# Altium schematic sheet [03] - CONNECTORS.SchDoc
size A2; DocumentNumber: 3; SheetNumber: 3; SheetTotal: 18
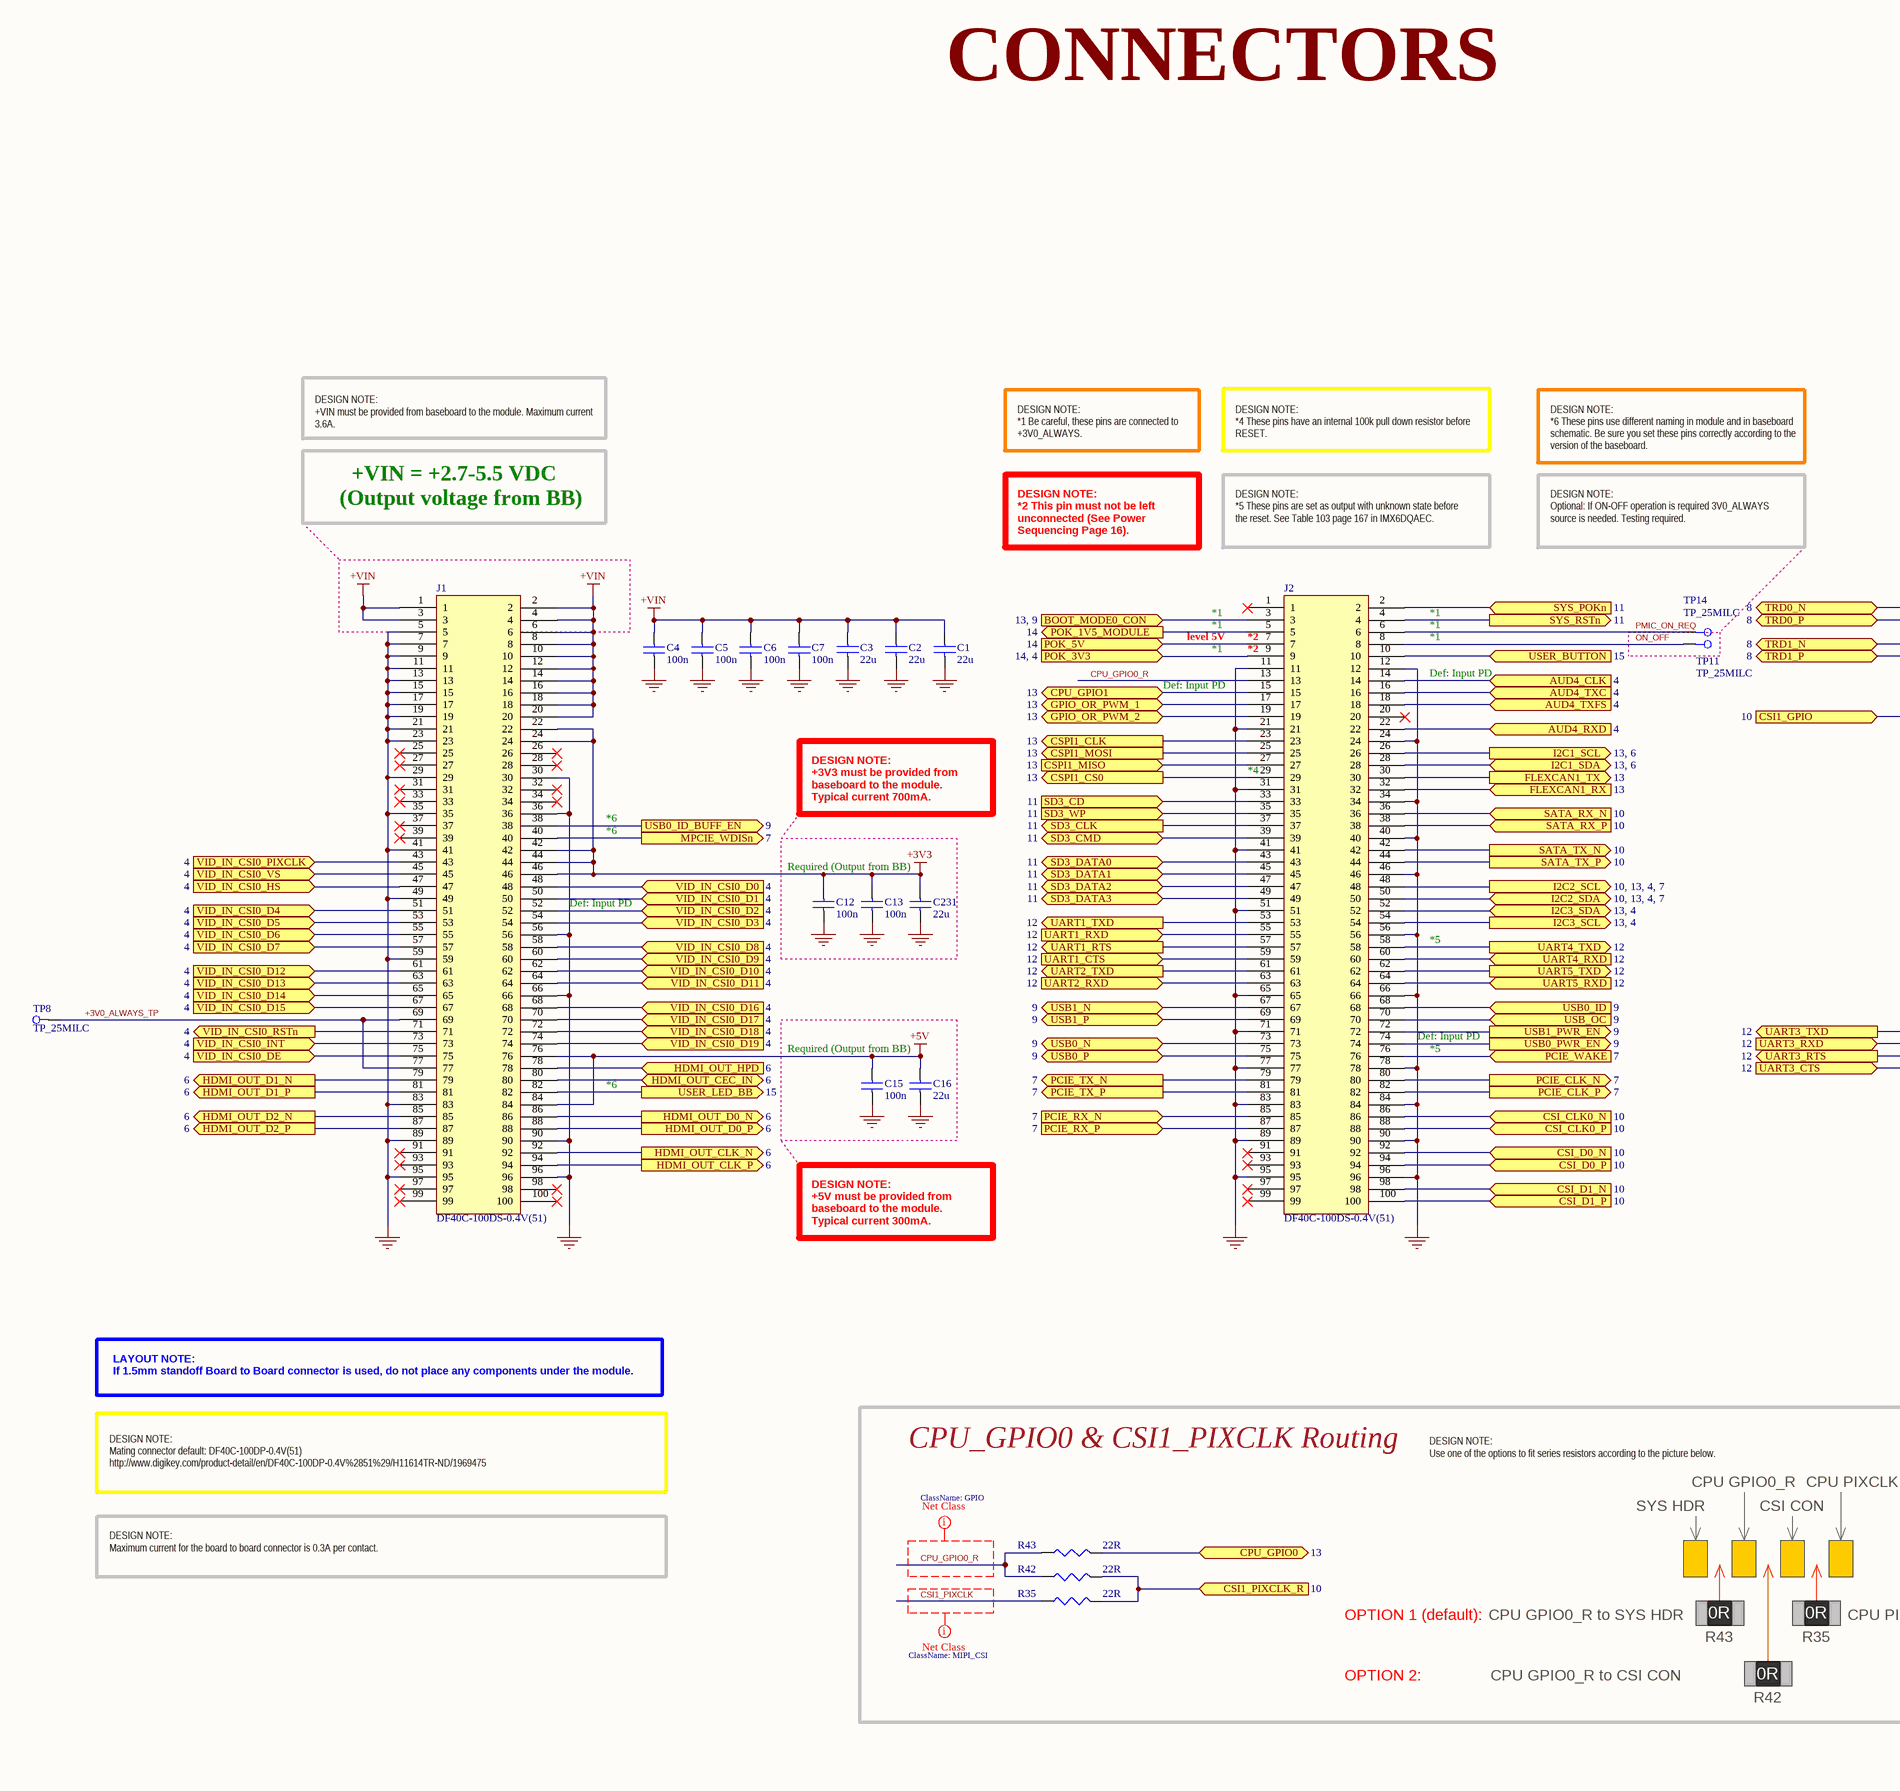
[diagram p0: [03] - CONNECTORS.SchDoc, left]
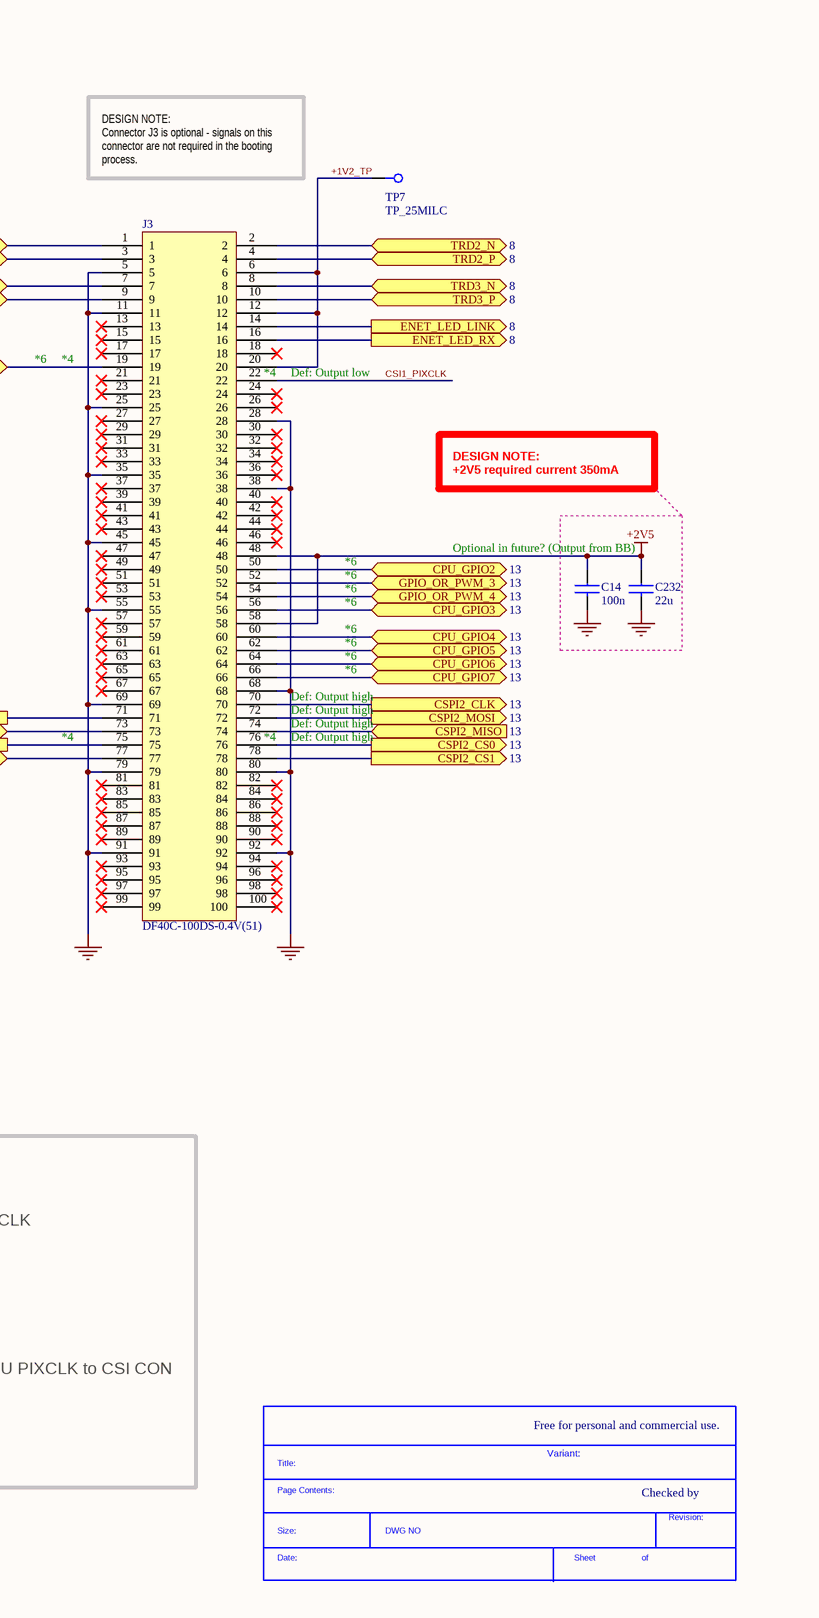
[diagram p1: [03] - CONNECTORS.SchDoc, right]

## Parts
*  SDTitleBlock  (value not drawn)  (graphical)
C1  22u  [C0603]
C2  22u  [C0603]
C3  22u  [C0603]
C4  100n  [C0402]
C5  100n  [C0402]
C6  100n  [C0402]
C7  100n  [C0402]
C12  100n  [C0402]
C13  100n  [C0402]
C14  100n  [C0402]
C15  100n  [C0402]
C16  22u  [C0603]
C231  22u  [C0603]
C232  22u  [C0603]
J1  DF40C-100DS-0.4V(51)  [DF40C-100DS-0.4V(51)_V1.1]
J2  DF40C-100DS-0.4V(51)  [DF40C-100DS-0.4V(51)_V1.1]
J3  DF40C-100DS-0.4V(51)  [DF40C-100DS-0.4V(51)_V1.1]
R35  22R  [R0402]
R42  22R  [R0402]
R43  22R  [R0402]
TP7  TP_25MILC  [TP_25C]  (no BOM)
TP8  TP_25MILC  [TP_25C]  (no BOM)
TP11  TP_25MILC  [TP_25C]  (no BOM)
TP14  TP_25MILC  [TP_25C]  (no BOM)

## Blocks framed on the sheet
Required (Output from BB): C12 C13 C231
Required (Output from BB): C15 C16
CPU_GPIO0 & CSI1_PIXCLK Routing: R35 R42 R43

## Ports
AUD4_CLK (in, see 4), AUD4_RXD (in, see 4), AUD4_TXC (in, see 4), AUD4_TXFS (in, see 4), BOOT_MODE0_CON (see 13, 9), CPU_GPIO0 (bidir, see 13), CPU_GPIO1 (bidir, see 13), CPU_GPIO2 (bidir, see 13), CPU_GPIO3 (bidir, see 13), CPU_GPIO4 (bidir, see 13), CPU_GPIO5 (bidir, see 13), CPU_GPIO6 (bidir, see 13), CPU_GPIO7 (bidir, see 13), CSI1_GPIO (in, see 10), CSI1_PIXCLK_R (in, see 10), CSI_CLK0_N (in, see 10), CSI_CLK0_P (in, see 10), CSI_D0_N (in, see 10), CSI_D0_P (in, see 10), CSI_D1_N (in, see 10), CSI_D1_P (in, see 10), CSPI1_CLK (out, see 13), CSPI1_CS0 (out, see 13), CSPI1_MISO (in, see 13), CSPI1_MOSI (out, see 13), CSPI2_CLK (out, see 13), CSPI2_CS0 (out, see 13), CSPI2_CS1 (out, see 13), CSPI2_MISO (in, see 13), CSPI2_MOSI (out, see 13), ENET_LED_LINK (out, see 8), ENET_LED_RX (out, see 8), FLEXCAN1_RX (in, see 13), FLEXCAN1_TX (out, see 13), GPIO_OR_PWM_1 (bidir, see 13), GPIO_OR_PWM_2 (bidir, see 13), GPIO_OR_PWM_3 (bidir, see 13), GPIO_OR_PWM_4 (bidir, see 13), HDMI_OUT_CEC_IN (bidir, see 6), HDMI_OUT_CLK_N (out, see 6), HDMI_OUT_CLK_P (out, see 6), HDMI_OUT_D0_N (out, see 6), HDMI_OUT_D0_P (out, see 6), HDMI_OUT_D1_N (out, see 6), HDMI_OUT_D1_P (out, see 6), HDMI_OUT_D2_N (out, see 6), HDMI_OUT_D2_P (out, see 6), HDMI_OUT_HPD (in, see 6), I2C1_SCL (see 13, 6), I2C1_SDA (bidir, see 13, 6), I2C2_SCL (see 10, 13, 4, 7), I2C2_SDA (bidir, see 10, 13, 4, 7), I2C3_SCL (see 13, 4), I2C3_SDA (bidir, see 13, 4), MPCIE_WDISn (out, see 7), PCIE_CLK_N (out, see 7), PCIE_CLK_P (out, see 7), PCIE_RX_N (in, see 7), PCIE_RX_P (in, see 7), PCIE_TX_N (out, see 7), PCIE_TX_P (out, see 7), PCIE_WAKE (in, see 7), POK_1V5_MODULE (out, see 14), POK_3V3 (see 14, 4), POK_5V (in, see 14), SATA_RX_N (in, see 10), SATA_RX_P (in, see 10), SATA_TX_N (out, see 10), SATA_TX_P (out, see 10), SD3_CD (in, see 11), SD3_CLK (out, see 11), SD3_CMD (bidir, see 11), SD3_DATA0 (bidir, see 11), SD3_DATA1 (bidir, see 11), SD3_DATA2 (bidir, see 11), SD3_DATA3 (bidir, see 11), SD3_WP (in, see 11), SYS_POKn (in, see 11), SYS_RSTn (out, see 11), TRD0_N (bidir, see 8), TRD0_P (bidir, see 8), TRD1_N (bidir, see 8), TRD1_P (bidir, see 8), TRD2_N (bidir, see 8), TRD2_P (bidir, see 8), TRD3_N (bidir, see 8), TRD3_P (bidir, see 8), UART1_CTS (in, see 12), UART1_RTS (out, see 12), UART1_RXD (in, see 12), UART1_TXD (out, see 12), UART2_RXD (in, see 12), UART2_TXD (out, see 12), UART3_CTS (in, see 12), UART3_RTS (out, see 12), UART3_RXD (in, see 12), UART3_TXD (out, see 12), UART4_RXD (in, see 12), UART4_TXD (out, see 12), UART5_RXD (in, see 12), UART5_TXD (out, see 12), USB0_ID (in, see 9), USB0_ID_BUFF_EN (out, see 9), USB0_N (bidir, see 9), USB0_P (bidir, see 9), USB0_PWR_EN (out, see 9), USB1_N (bidir, see 9), USB1_P (bidir, see 9), USB1_PWR_EN (out, see 9), USB_OC (in, see 9), USER_BUTTON (in, see 15), USER_LED_BB (out, see 15), VID_IN_CSI0_D0 (in, see 4), VID_IN_CSI0_D1 (in, see 4), VID_IN_CSI0_D2 (in, see 4), VID_IN_CSI0_D3 (in, see 4), VID_IN_CSI0_D4 (in, see 4), VID_IN_CSI0_D5 (in, see 4), VID_IN_CSI0_D6 (in, see 4), VID_IN_CSI0_D7 (in, see 4), VID_IN_CSI0_D8 (in, see 4), VID_IN_CSI0_D9 (in, see 4), VID_IN_CSI0_D10 (in, see 4), VID_IN_CSI0_D11 (in, see 4), VID_IN_CSI0_D12 (in, see 4), VID_IN_CSI0_D13 (in, see 4), VID_IN_CSI0_D14 (in, see 4), VID_IN_CSI0_D15 (in, see 4), VID_IN_CSI0_D16 (in, see 4), VID_IN_CSI0_D17 (in, see 4), VID_IN_CSI0_D18 (in, see 4), VID_IN_CSI0_D19 (in, see 4), VID_IN_CSI0_DE (in, see 4), VID_IN_CSI0_HS (in, see 4), VID_IN_CSI0_INT (in, see 4), VID_IN_CSI0_PIXCLK (in, see 4), VID_IN_CSI0_RSTn (out, see 4), VID_IN_CSI0_VS (in, see 4)

## Nets
+2V5: C14.1 C232.1 J3.48 J3.58
+3V3: C12.1 C13.1 C231.1 J1.22 J1.24 J1.42 J1.44 J1.46
+5V: C15.1 C16.1 J1.76 J1.84
+VIN: C1.1 C2.1 C3.1 C4.1 C5.1 C6.1 C7.1 J1.1 J1.2 J1.3 J1.4 J1.6 J1.8 J1.10 J1.12 J1.14 J1.16 J1.18 J1.20
GND: C1.2 C2.2 C3.2 C4.2 C5.2 C6.2 C7.2 C12.2 C13.2 C14.2 C15.2 C16.2 C231.2 C232.2 J1.5 J1.7 J1.9 J1.11 J1.13 J1.15 J1.17 J1.19 J1.21 J1.23 J1.29 J1.30 J1.35 J1.36 J1.41 J1.49 J1.56 J1.59 J1.66 J1.83 J1.89 J1.90 J1.95 J1.96 J2.11 J2.12 J2.21 J2.24 J2.31 J2.34 J2.40 J2.41 J2.46 J2.51 J2.56 J2.65 J2.66 J2.71 J2.77 J2.78 J2.83 J2.84 J2.89 J2.90 J2.95 J2.96 J3.5 J3.11 J3.25 J3.28 J3.35 J3.38 J3.45 J3.55 J3.68 J3.69 J3.79 J3.80 J3.91 J3.92
+1V2_TP: J3.6 J3.12 J3.20 TP7.1
+3V0_ALWAYS_TP: J1.69 J1.77 TP8.1
AUD4_CLK: J2.14 ; port AUD4_CLK
AUD4_RXD: J2.22 ; port AUD4_RXD
AUD4_TXC: J2.16 ; port AUD4_TXC
AUD4_TXFS: J2.18 ; port AUD4_TXFS
BOOT_MODE0_CON: J2.3 ; port BOOT_MODE0_CON
CPU_GPIO0: R43.2 ; port CPU_GPIO0
CPU_GPIO0_R: J2.13 R42.1 R43.1
CPU_GPIO1: J2.15 ; port CPU_GPIO1
CPU_GPIO2: J3.50 ; port CPU_GPIO2
CPU_GPIO3: J3.56 ; port CPU_GPIO3
CPU_GPIO4: J3.60 ; port CPU_GPIO4
CPU_GPIO5: J3.62 ; port CPU_GPIO5
CPU_GPIO6: J3.64 ; port CPU_GPIO6
CPU_GPIO7: J3.66 ; port CPU_GPIO7
CSI1_GPIO: J3.19 ; port CSI1_GPIO
CSI1_PIXCLK: J3.22 R35.1
CSI1_PIXCLK_R: R35.2 R42.2 ; port CSI1_PIXCLK_R
CSI_CLK0_N: J2.86 ; port CSI_CLK0_N
CSI_CLK0_P: J2.88 ; port CSI_CLK0_P
CSI_D0_N: J2.92 ; port CSI_D0_N
CSI_D0_P: J2.94 ; port CSI_D0_P
CSI_D1_N: J2.98 ; port CSI_D1_N
CSI_D1_P: J2.100 ; port CSI_D1_P
CSPI1_CLK: J2.23 ; port CSPI1_CLK
CSPI1_CS0: J2.29 ; port CSPI1_CS0
CSPI1_MISO: J2.27 ; port CSPI1_MISO
CSPI1_MOSI: J2.25 ; port CSPI1_MOSI
CSPI2_CLK: J3.70 ; port CSPI2_CLK
CSPI2_CS0: J3.76 ; port CSPI2_CS0
CSPI2_CS1: J3.78 ; port CSPI2_CS1
CSPI2_MISO: J3.74 ; port CSPI2_MISO
CSPI2_MOSI: J3.72 ; port CSPI2_MOSI
ENET_LED_LINK: J3.14 ; port ENET_LED_LINK
ENET_LED_RX: J3.16 ; port ENET_LED_RX
FLEXCAN1_RX: J2.32 ; port FLEXCAN1_RX
FLEXCAN1_TX: J2.30 ; port FLEXCAN1_TX
GPIO_OR_PWM_1: J2.17 ; port GPIO_OR_PWM_1
GPIO_OR_PWM_2: J2.19 ; port GPIO_OR_PWM_2
GPIO_OR_PWM_3: J3.52 ; port GPIO_OR_PWM_3
GPIO_OR_PWM_4: J3.54 ; port GPIO_OR_PWM_4
HDMI_OUT_CEC_IN: J1.80 ; port HDMI_OUT_CEC_IN
HDMI_OUT_CLK_N: J1.92 ; port HDMI_OUT_CLK_N
HDMI_OUT_CLK_P: J1.94 ; port HDMI_OUT_CLK_P
HDMI_OUT_D0_N: J1.86 ; port HDMI_OUT_D0_N
HDMI_OUT_D0_P: J1.88 ; port HDMI_OUT_D0_P
HDMI_OUT_D1_N: J1.79 ; port HDMI_OUT_D1_N
HDMI_OUT_D1_P: J1.81 ; port HDMI_OUT_D1_P
HDMI_OUT_D2_N: J1.85 ; port HDMI_OUT_D2_N
HDMI_OUT_D2_P: J1.87 ; port HDMI_OUT_D2_P
HDMI_OUT_HPD: J1.78 ; port HDMI_OUT_HPD
I2C1_SCL: J2.26 ; port I2C1_SCL
I2C1_SDA: J2.28 ; port I2C1_SDA
I2C2_SCL: J2.48 ; port I2C2_SCL
I2C2_SDA: J2.50 ; port I2C2_SDA
I2C3_SCL: J2.54 ; port I2C3_SCL
I2C3_SDA: J2.52 ; port I2C3_SDA
MPCIE_WDISn: J1.40 ; port MPCIE_WDISn
ON_OFF: J2.8 TP11.1
PCIE_CLK_N: J2.80 ; port PCIE_CLK_N
PCIE_CLK_P: J2.82 ; port PCIE_CLK_P
PCIE_RX_N: J2.85 ; port PCIE_RX_N
PCIE_RX_P: J2.87 ; port PCIE_RX_P
PCIE_TX_N: J2.79 ; port PCIE_TX_N
PCIE_TX_P: J2.81 ; port PCIE_TX_P
PCIE_WAKE: J2.76 ; port PCIE_WAKE
PMIC_ON_REQ: J2.6 TP14.1
POK_1V5_MODULE: J2.5 ; port POK_1V5_MODULE
POK_3V3: J2.9 ; port POK_3V3
POK_5V: J2.7 ; port POK_5V
SATA_RX_N: J2.36 ; port SATA_RX_N
SATA_RX_P: J2.38 ; port SATA_RX_P
SATA_TX_N: J2.42 ; port SATA_TX_N
SATA_TX_P: J2.44 ; port SATA_TX_P
SD3_CD: J2.33 ; port SD3_CD
SD3_CLK: J2.37 ; port SD3_CLK
SD3_CMD: J2.39 ; port SD3_CMD
SD3_DATA0: J2.43 ; port SD3_DATA0
SD3_DATA1: J2.45 ; port SD3_DATA1
SD3_DATA2: J2.47 ; port SD3_DATA2
SD3_DATA3: J2.49 ; port SD3_DATA3
SD3_WP: J2.35 ; port SD3_WP
SYS_POKn: J2.2 ; port SYS_POKn
SYS_RSTn: J2.4 ; port SYS_RSTn
TRD0_N: J3.1 ; port TRD0_N
TRD0_P: J3.3 ; port TRD0_P
TRD1_N: J3.7 ; port TRD1_N
TRD1_P: J3.9 ; port TRD1_P
TRD2_N: J3.2 ; port TRD2_N
TRD2_P: J3.4 ; port TRD2_P
TRD3_N: J3.8 ; port TRD3_N
TRD3_P: J3.10 ; port TRD3_P
UART1_CTS: J2.59 ; port UART1_CTS
UART1_RTS: J2.57 ; port UART1_RTS
UART1_RXD: J2.55 ; port UART1_RXD
UART1_TXD: J2.53 ; port UART1_TXD
UART2_RXD: J2.63 ; port UART2_RXD
UART2_TXD: J2.61 ; port UART2_TXD
UART3_CTS: J3.77 ; port UART3_CTS
UART3_RTS: J3.75 ; port UART3_RTS
UART3_RXD: J3.73 ; port UART3_RXD
UART3_TXD: J3.71 ; port UART3_TXD
UART4_RXD: J2.60 ; port UART4_RXD
UART4_TXD: J2.58 ; port UART4_TXD
UART5_RXD: J2.64 ; port UART5_RXD
UART5_TXD: J2.62 ; port UART5_TXD
USB0_ID: J2.68 ; port USB0_ID
USB0_ID_BUFF_EN: J1.38 ; port USB0_ID_BUFF_EN
USB0_N: J2.73 ; port USB0_N
USB0_P: J2.75 ; port USB0_P
USB0_PWR_EN: J2.74 ; port USB0_PWR_EN
USB1_N: J2.67 ; port USB1_N
USB1_P: J2.69 ; port USB1_P
USB1_PWR_EN: J2.72 ; port USB1_PWR_EN
USB_OC: J2.70 ; port USB_OC
USER_BUTTON: J2.10 ; port USER_BUTTON
USER_LED_BB: J1.82 ; port USER_LED_BB
VID_IN_CSI0_D0: J1.48 ; port VID_IN_CSI0_D0
VID_IN_CSI0_D1: J1.50 ; port VID_IN_CSI0_D1
VID_IN_CSI0_D2: J1.52 ; port VID_IN_CSI0_D2
VID_IN_CSI0_D3: J1.54 ; port VID_IN_CSI0_D3
VID_IN_CSI0_D4: J1.51 ; port VID_IN_CSI0_D4
VID_IN_CSI0_D5: J1.53 ; port VID_IN_CSI0_D5
VID_IN_CSI0_D6: J1.55 ; port VID_IN_CSI0_D6
VID_IN_CSI0_D7: J1.57 ; port VID_IN_CSI0_D7
VID_IN_CSI0_D8: J1.58 ; port VID_IN_CSI0_D8
VID_IN_CSI0_D9: J1.60 ; port VID_IN_CSI0_D9
VID_IN_CSI0_D10: J1.62 ; port VID_IN_CSI0_D10
VID_IN_CSI0_D11: J1.64 ; port VID_IN_CSI0_D11
VID_IN_CSI0_D12: J1.61 ; port VID_IN_CSI0_D12
VID_IN_CSI0_D13: J1.63 ; port VID_IN_CSI0_D13
VID_IN_CSI0_D14: J1.65 ; port VID_IN_CSI0_D14
VID_IN_CSI0_D15: J1.67 ; port VID_IN_CSI0_D15
VID_IN_CSI0_D16: J1.68 ; port VID_IN_CSI0_D16
VID_IN_CSI0_D17: J1.70 ; port VID_IN_CSI0_D17
VID_IN_CSI0_D18: J1.72 ; port VID_IN_CSI0_D18
VID_IN_CSI0_D19: J1.74 ; port VID_IN_CSI0_D19
VID_IN_CSI0_DE: J1.75 ; port VID_IN_CSI0_DE
VID_IN_CSI0_HS: J1.47 ; port VID_IN_CSI0_HS
VID_IN_CSI0_INT: J1.73 ; port VID_IN_CSI0_INT
VID_IN_CSI0_PIXCLK: J1.43 ; port VID_IN_CSI0_PIXCLK
VID_IN_CSI0_RSTn: J1.71 ; port VID_IN_CSI0_RSTn
VID_IN_CSI0_VS: J1.45 ; port VID_IN_CSI0_VS

Not connected (* = marked no-connect by the designer): J1 25* 26* 27* 28* 31* 32* 33* 34* 37* 39* 91* 93* 97* 98* 99* 100*; J2 1* 20* 91* 93* 97* 99*; J3 13* 15* 17* 18* 21* 23* 24* 26* 27* 29* 30* 31* 32* 33* 34* 36* 37* 39* 40* 41* 42* 43* 44* 46* 47* 49* 51* 53* 57* 59* 61* 63* 65* 67* 81* 82* 83* 84* 85* 86* 87* 88* 89* 90* 93* 94* 95* 96* 97* 98* 99* 100*

## Layout directives
net class MIPI_CSI: CSI1_PIXCLK
net class GPIO: CPU_GPIO0_R

## Notes on the sheet
- CONNECTORS
- DESIGN NOTE:
  +VIN must be provided from baseboard to the module. Maximum current 3.6A.
- DESIGN NOTE:
  *1 Be careful, these pins are connected to +3V0_ALWAYS.
- DESIGN NOTE:
  *4 These pins have an internal 100k pull down resistor before RESET.
- DESIGN NOTE:
  *6 These pins use different naming in module and in baseboard schematic. Be sure you set these pins correctly according to the version of the baseboard.
- (Output voltage from BB)
- +VIN = +2.7-5.5 VDC
- DESIGN NOTE:
  *2 This pin must not be left unconnected (See Power Sequencing Page 16).
- DESIGN NOTE:
  *5 These pins are set as output with unknown state before the reset. See Table 103 page 167 in IMX6DQAEC.
- DESIGN NOTE:
  Optional: If ON-OFF operation is required 3V0_ALWAYS source is needed. Testing required.
- DESIGN NOTE:
  Connector J3 is optional - signals on this connector are not required in the booting process.
- level 5V
- *1
- (near J2) *2
- Def: Input PD
- *6
- *4
- (near J2) *4
- (near J3) *4
- Def: Output low
- DESIGN NOTE:
  +3V3 must be provided from baseboard to the module. Typical current 700mA.
- DESIGN NOTE:
  +2V5 required current 350mA
- Optional in future? (Output from BB)
- *5
- Def: Output high
- DESIGN NOTE:
  +5V must be provided from baseboard to the module. Typical current 300mA.
- LAYOUT NOTE:
  If 1.5mm standoff Board to Board connector is used, do not place any components under the module.
- DESIGN NOTE:
  Mating connector default: DF40C-100DP-0.4V(51)
  http://www.digikey.com/product-detail/en/DF40C-100DP-0.4V%2851%29/H11614TR-ND/1969475
- DESIGN NOTE:
  Use one of the options to fit series resistors according to the picture below.
- CPU GPIO0_R
- CPU PIXCLK
- SYS HDR
- CSI CON
- DESIGN NOTE:
  Maximum current for the board to board connector is 0.3A per contact.
- OPTION 1 (default):
- CPU GPIO0_R to SYS HDR
- 0R
- CPU PIXCLK to CSI CON
- OPTION 2:
- CPU GPIO0_R to CSI CON
- R43
- R35
- Free for personal and commercial use.
- R42
- Variant:
- Checked by
- (in symbol SDTitleBlock) Title:; Page Contents:; Revision:; Size:; DWG NO; Date:; Sheet; of

## Library data of the parts
C1-C3 C16 C231 C232 = C1608X5R0J226M080AC: CAP CER 22UF 6.3V 20% X5R 0603; Manufacturer: TDK Corporation; Capacitance: 22µF; .Creator: MM; Supplier 1: Digi-Key; Manufacturer Part Number: C1608X5R0J226M080AC; RoHS: RoHS Compliant; Category: Capacitors; Stock 1: 593047; Pricing 1: 1=0.39, 10=0.343, 100=0.1714, 250=0.13708, 500=0.12484, 1000=0.1104 (USD); Packaging: Cut Tape (CT); Tolerance: ±20%; Voltage - Rated: 6.3V; Temperature Coefficient: X5R; Mounting Type: Surface Mount, MLCC; Operating Temperature: -55°C ~ 85°C; Applications: General Purpose; Ratings: -; Package / Case: 0603 (1608 Metric); Size / Dimension: 0.063" L x 0.031" W (1.60mm x 0.80mm); Height - Seated (Max): -; Thickness (Max): 0.039" (1.00mm); Lead Spacing: -; Features: -; Lead Style: -; ComponentLink1URL: http://product.tdk.com/en/catalog/datasheets/mlcc_commercial_general_en.pdf; ComponentLink1Description: http://product.tdk.com/en/catalog/datasheets/mlcc_commercial_general_en.pdf; Supplier Part Number 1: 445-8028-1-ND; .Checked PCB: MM; .Checked SCH: MM
C4-C7 C12-C15 = C1005X5R1H104K: CAP CER .10UF 50V X5R 10% 0402; Manufacturer: TDK Corporation; Capacitance: 0.1µF; Value: 100nF; .Checked PCB: used; Category: Capacitors; Supplier Part Number: 445-5942-1-ND; Manufacturer Part Number: C1005X5R1H104K; Operating Temperature: -55°C ~ 85°C; Package / Case: 0402 (1005 Metric); Price 1k [$]: 0.02340; .Checked SCH: used; Voltage - Rated: 50V; Supplier: Digikey; Supplier 1: Digi-Key; Supplier Part Number 1: 445-5942-1-ND; RoHS: RoHS Compliant; Stock 1: 106926; Pricing 1: 1=0.27, 10=0.18, 100=0.072, 250=0.05176, 500=0.0369, 1000=0.027 (USD); Tolerance: ±10%; Temperature Coefficient: X5R; Mounting Type: Surface Mount, MLCC; Applications: General Purpose; Ratings: -; Size / Dimension: 0.039" L x 0.020" W (1.00mm x 0.50mm); Height - Seated (Max): -; Thickness (Max): 0.022" (0.55mm); Lead Spacing: -; Features: -; Packaging: Cut Tape (CT); Lead Style: -; ComponentLink1URL: http://www.tdk.co.jp/tefe02/e412_c.pdf; ComponentLink1Description: http://www.tdk.co.jp/tefe02/e412_c.pdf
J1-J3 = DF40C-100DS-0.4V(51)_v1.1: CONN RCPT 100POS 0.4MM SMD GOLD; Manufacturer: Hirose Electric Co Ltd; Connector Type: Receptacle, Center Strip Contacts; Number of Positions: 100; Pitch: 0.016" (0.40mm); Mated Stacking Heights: 1.5mm; .Creator: MM; Supplier 1: Digi-Key; Manufacturer Part Number: DF40C-100DS-0.4V(51); RoHS: RoHS Compliant; Category: Connectors, Interconnects; Stock 1: 35907; Pricing 1: 1=1.84, 10=1.671, 25=1.5688, 50=1.5004, 100=1.4322, 250=1.2958, 500=1.1935, 1000=1.023, 2500=0.9548 (USD); Packaging: Cut Tape (CT); Number of Rows: 2; Mounting Type: Surface Mount; Features: -; Contact Finish: Gold; Contact Finish Thickness: -; Height Above Board: 0.057" (1.45mm); ComponentLink1URL: http://www.hirose.co.jp/cataloge_hp/ed_DF40_20140305.pdf; ComponentLink1Description: http://www.hirose.co.jp/cataloge_hp/ed_DF40_20140305.pdf; .Checked PCB: MM; .Checked SCH: MM; Supplier Part Number 1: H11615CT-ND
R35 R42 R43 = RC0402FR-0722RL: RES 22.0 OHM 1/16W 1% 0402 SMD; Manufacturer: Yageo; Resistance (Ohms): 22; Power (Watts): 0.063W, 1/16W; .Checked PCB: used; Temperature Coefficient: ±100ppm/°C; Category: Resistors; Supplier Part Number: 311-22.0LRCT-ND; Manufacturer Part Number: RC0402FR-0722RL; Package / Case: 0402 (1005 Metric); Price 1k [$]: 0.01421; Tolerance: ±1%; Value: 22R; .Checked SCH: used; Supplier: Digikey; Supplier 1: Digi-Key; Supplier Part Number 1: 311-22.0LRCT-ND; RoHS: RoHS Compliant; Stock 1: 943800; Pricing 1: 10=0.014, 50=0.0104, 100=0.0079, 250=0.00584, 500=0.00432, 1000=0.00288 (USD); Composition: Thick Film; Features: -; Size / Dimension: 0.039" L x 0.020" W (1.00mm x 0.50mm); Height: 0.016" (0.40mm); Number of Terminations: 2; Packaging: Cut Tape (CT); ComponentLink1URL: http://www.yageo.com/documents/recent/PYu-RC0402_51_RoHS_L_6.pdf; ComponentLink1Description: http://www.yageo.com/documents/recent/PYu-RC0402_51_RoHS_L_6.pdf
TP7 TP8 TP11 TP14 = TP_25MILC: Test Point 25mil